# Altium schematic sheet Power_suply.SchDoc: Power suply
size A4; Date: 6.4.2015; Engineer: Matjaz Tome; DocumentNumber: 4; Revision: B1; SheetNumber: 4; SheetTotal: 8; Project: USB DAQ
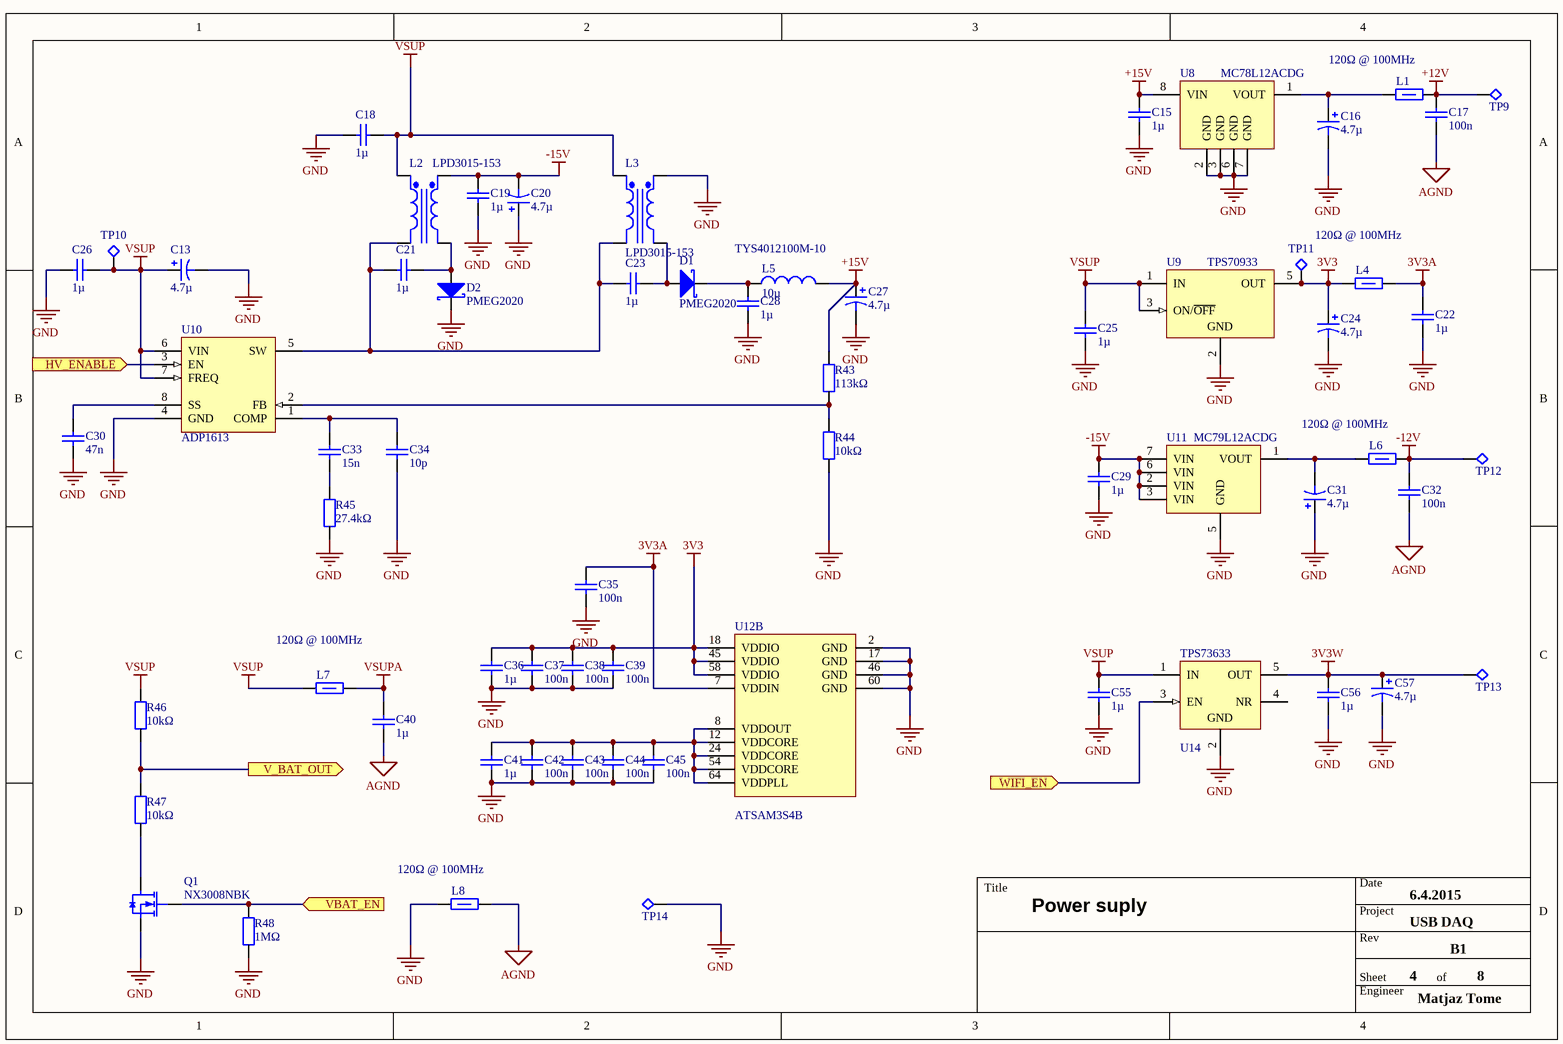
[diagram p0: Power_suply.SchDoc]

## Parts
C13  4.7µ  [A]
C15  1µ  [0603C]
C16  4.7µ  [A]
C17  100n  [0603C]
C18  1µ  [0603C]
C19  1µ  [0603C]
C20  4.7µ  [A]
C21  1µ  [0603C]
C22  1µ  [0603C]
C23  1µ  [0603C]
C24  4.7µ  [A]
C25  1µ  [0603C]
C26  1µ  [0603C]
C27  4.7µ  [A]
C28  1µ  [0603C]
C29  1µ  [0603C]
C30  47n  [0603C]
C31  4.7µ  [A]
C32  100n  [0603C]
C33  15n  [0603C]
C34  10p  [0603C]
C35  100n  [0603C]
C36  1µ  [0603C]
C37  100n  [0603C]
C38  100n  [0603C]
C39  100n  [0603C]
C40  1µ  [0603C]
C41  1µ  [0603C]
C42  100n  [0603C]
C43  100n  [0603C]
C44  100n  [0603C]
C45  100n  [0603C]
C55  1µ  [0603C]
C56  1µ  [0603C]
C57  4.7µ  [A]
D1  PMEG2020  [SOD323]
D2  PMEG2020  [SOD323]
L1  120Ω @ 100MHz  [0805R]
L2  LPD3015-153  [LPD3015]
L3  LPD3015-153  [LPD3015]
L4  120Ω @ 100MHz  [0805R]
L5  10µ  Manufacturer Number: TYS4012100M-10  [ind_4mmX4mm]
L6  120Ω @ 100MHz  [0805R]
L7  120Ω @ 100MHz  [0805R]
L8  120Ω @ 100MHz  [0805R]
Q1  NX3008NBK  [SOT23-3]
R43  113kΩ  [0603R]
R44  10kΩ  [0603R]
R45  27.4kΩ  [0603R]
R46  10kΩ  [0603R]
R47  10kΩ  [0603R]
R48  1MΩ  [0603R]
TP9  testpoint  [TP1_FULL]  (value not drawn)  (no BOM)
TP10  testpoint  [TP1_FULL]  (value not drawn)  (no BOM)
TP11  testpoint  [TP1_FULL]  (value not drawn)  (no BOM)
TP12  testpoint  [TP1_FULL]  (value not drawn)  (no BOM)
TP13  testpoint  [TP1_FULL]  (value not drawn)  (no BOM)
TP14  testpoint  [TP1_FULL]  (value not drawn)  (no BOM)
U8  MC78L12ACDG  [SOIC8]
U9  TPS70933  [SOT23-5]
U10  ADP1613  [MSOP8]
U11  MC79L12ACDG  [SOIC8]
U12  ATSAM3S4B  [LQFP64]  (part B of 2)
U14  TPS73633  [SOT23-5]

## Ports
HV_ENABLE (in), V_BAT_OUT (out), VBAT_EN (in), WIFI_EN (in)

## Nets
3V3: C24.1 C36.2 C37.1 C38.1 C39.1 L4.1 TP11.1 U9.5(OUT) U12.18(VDDIO) U12.45(VDDIO) U12.58(VDDIO)
3V3A: C22.2 C35.1 L4.2 U12.7(VDDIN)
3V3W: C56.2 C57.1 TP13.1 U14.5(OUT)
+12V: C17.1 L1.2 TP9.1
+15V: C15.2 C27.1 L5.2 R43.2 U8.8(VIN)
-12V: C32.1 L6.2 TP12.1
-15V: C19.2 C20.2 C29.2 L2.1 U11.2(VIN) U11.3(VIN) U11.6(VIN) U11.7(VIN)
AGND: C17.2 C32.2 C40.1 L8.2
GND: C13.2 C15.1 C16.2 C18.2 C19.1 C20.1 C22.1 C24.2 C25.1 C26.1 C27.2 C28.1 C29.1 C30.1 C31.1 C34.1 C35.2 C36.1 C37.2 C38.2 C39.2 C41.1 C42.2 C43.2 C44.2 C45.2 C55.1 C56.1 C57.2 D2.2(K) L3.4 L8.1 Q1.2(S) R44.1 R45.1 R48.1 TP14.1 U8.2(GND) U8.3(GND) U8.6(GND) U8.7(GND) U9.2(GND) U10.4(GND) U11.5(GND) U12.2(GND) U12.17(GND) U12.46(GND) U12.60(GND) U14.2(GND)
VSUP: C13.1 C18.1 C25.2 C26.2 C55.2 L2.4 L3.1 L7.1 R46.2 TP10.1 U9.1(IN) U9.3(ON/~{OFF}) U10.6(VIN) U10.7(FREQ) U14.1(IN)
VSUPA: C40.2 L7.2
HV_ENABLE: U10.3(EN) ; port HV_ENABLE
V_BAT_OUT: R46.1 R47.2 ; port V_BAT_OUT
VBAT_EN: Q1.1(G) R48.2 ; port VBAT_EN
WIFI_EN: U14.3(EN) ; port WIFI_EN
NetC16_1: C16.1 L1.1 U8.1(VOUT)
NetC21_1: C21.1 D2.1(A) L2.2
NetC21_2: C21.2 C23.2 L2.3 L3.2 U10.5(SW)
NetC23_1: C23.1 D1.1(A) L3.3
NetC28_2: C28.2 D1.2(K) L5.1
NetC30_2: C30.2 U10.8(SS)
NetC31_2: C31.2 L6.1 U11.1(VOUT)
NetC33_1: C33.1 R45.2
NetC33_2: C33.2 C34.2 U10.1(COMP)
NetC41_2: C41.2 C42.1 C43.1 C44.1 C45.1 U12.8(VDDOUT) U12.12(VDDCORE) U12.24(VDDCORE) U12.54(VDDCORE) U12.64(VDDPLL)
NetQ1_3: Q1.3(D) R47.1
NetR43_1: R43.1 R44.2 U10.2(FB)

Not connected (* = marked no-connect by the designer): U14 4(NR)

## Notes on the sheet
- Title
- Date
- Project
- Rev
- Engineer
- Sheet
- of

## Library data of the parts
C13 C16 C20 C24 C27 C31 C57 = CST0011: tantalum SMD capacitor 4.7µF 16V A case; Manufacturer: Kemet; Manufacturer Number: T491A475M016AT; ESR: 4Ω; Tolerance: 10%; Part Number: CST0011; Category: Capacitors; Supplier part number 1: 2462769; Supplier 1: Farnell; Price: 0.20; Value: 4.7µF; Voltage: 16V; Case: A; Technology: SMT; Dielectric: Tantalum; HelpURL: U:\datasheet\cap\KEMET TANT SMD.pdf
C15 C18 C19 C21-C23 C25 C26 C28 C29 C36 C40 C41 C55 C56 = ZSC0003: ceramic X5R SMD capacitor smd 0603 1µF 50V; Manufacturer: Murata; Manufacturer Number: GRM188R61H105KAALD; Tolerance: 10%; Part Number: ZSC0003; Category: capacitors; Price: 0.144; Value: 1µF; Voltage: 50V; Case: 0603; Technology: SMT; Dielectric: X5R; HelpURL: U:\datasheet\cap\Murata\GRM\GRM188R61H105KAALD.pdf; SKU: 1020300000001; Supplier part number 1: 1845736; Supplier 1: Farnell
C17 C32 C35 C37-C39 C42-C45 = RSC0013: ceramic X7R SMD capacitor smd 0603 100nF 16V; Manufacturer: Murata; Manufacturer Number: GRM188R71C104KA01D; Dealer number: 1828890; Dealer: Farnell; Tolerance: 10%; Part Number: RSC0013; Category: capacitors; Price: 0.042; Value: 100nF; Voltage: 16V; Case: 0603; Technology: SMT; Dielectric: X7R; HelpURL: U:\datasheet\cap\Murata\GRM\GRM188R71C104KA01D.pdf; Supplier 1: Farnell; Supplier Part Number 1: 1828890
C30 = RSC0007: ceramic X7R SMD capacitor smd 0603 47nF 16V; Manufacturer: Multicomp; Manufacturer Number: MC0603B473K160CT; Dealer number: 1759011; Dealer: Farnell; Tolerance: 10%; Part Number: RSC0007; Category: capacitors; Price: 0.009; Value: 47nF; Voltage: 16V; Case: 0603; Technology: SMT; Dielectric: X7R; HelpURL: U:\datasheet\cap\MULTICOMP_2.pdf; Supplier 1: Farnell; Supplier Part Number 1: 1759011
C33 = RSC0015: ceramic X7R SMD capacitor smd 0603 15nF 100V; Manufacturer: Kemet; Manufacturer Number: C0603C153K1RACTU; Dealer number: 1865546; Dealer: Farnell; Tolerance: 10%; Part Number: RSC0015; Category: capacitors; Price: 0.019; Value: 15nF; Voltage: 100V; Case: 0603; Technology: SMT; Dielectric: X7R; HelpURL: U:\datasheet\cap\KEMET X7R SMD.pdf; SKU: 1020100000009; Supplier 1: Farnell; Supplier Part Number 1: 1865546
C34 = GSC0019: ceramic C0G SMD capacitor smd 0603 10pF 100V; Manufacturer: Kemet; Manufacturer Number: C0603C100J1GACTU; Dealer number: 1414600; Dealer: Farnell; Tolerance: 5%; Part Number: GSC0019; Category: capacitors; Price: 0.038; Value: 10pF; Voltage: 100V; Case: 0603; Technology: SMT; Dielectric: C0G; HelpURL: U:\datasheet\cap\KEMET C0G SMD.pdf; SKU: 1020000000004; Supplier 1: Farnell; Supplier part number 1: 1414600
D1 D2 = XDS0004: Shotkey diode 2A 20V; Manufacturer: Infineon; Manufacturer Number: PMEG2020AEA; Part Number: XDS0004; Category: diodes; Price: 0.126; Max  Reverse Voltage: 20V; Max current: 2A; Case: SOD323; Technology: SMT; HelpURL: U:\datasheet\shotkey\PMEG2020.pdf; Supplier part number 1: 8737940; Supplier 1: Farnell
L1 L4 L6-L8 = XFB0000: Ferrite bead, 0.15Ω, 200mA, 0805, 120E @ 100MHz; Manufacturer: Murata; Manufacturer Number: BLM21AG121SN1D; Dealer number: 1515617; Dealer: Farnell; Max current: 0.2A; Part Number: XFB0000; Category: ferite beads; Price: 0.082; DC resistance: 0.15Ω; AC resistance: 120Ω; Frequency: 100MHz; Case: 0805; Technology: SMT; HelpURL: U:\datasheet\ferrite_beads\BLM21A.pdf; Supplier 1: Farnell; Supplier part number 1: 1515617
L2 L3 = XCI0000: Coupled Inductors; Manufacturer: Coilcraft; Manufacturer Number: LPD3015-153MRB; Value: 15µH; Current RMS: 460mA; Current Satturation: 500mA; Resistance: 1.42Ω; Tolerance: 20%; Part Number: XCI0000; Category: Inductors; Price: 0.82; Case: LPD3015; Technology: SMT; HelpURL: U:\datasheet\inductors_coupled\LPD3015.pdf; Supplier part number 1: 2407927; Supplier 1: Farnell
L5 = XXI0000: SMD inductor 10µH, 0.8A; Manufacturer: Laird Technologies; Type: Power; Dealer number: 2292514; Dealer: Farnell; Current RMS: 770mA; Current Satturation: 800mA; Resistance: 0.265Ω; Tolerance: 20%; Part Number: XXI0000; Category: Inductors; Price: 0.26; Value: 10µH; Case: 4mm X 4mm; Technology: SMT; HelpURL: U:\datasheet\inductors_smd\power\TYS4012100M-10.pdf; Supplier 1: Farnell; Supplier Part Number 1: 2292514
Q1 = XMN0003: 30V 0.4A N-mosfet; Manufacturer: NXP; RDS: 1Ω; Max power disipation: 350mW; Type: N-enhancment mode; Logic level: Yes; Part Number: XMN0003; Category: mosfets; Supplier part number 1: 2069541; Supplier 1: Farnell; Price: 0.053; Manufacturer Number: NX3008NBK; Max voltage: 30V; Max current: 0.4A; Case: SOT23-3; Technology: SMT; HelpURL: U:\datasheet\nmos\NX3008NBK.pdf
R43 = YRS0021: resistor smd 0603 113kΩ 1% 0.1w; Manufacturer: Vishay; Manufacturer Number: CRCW0603113KFKEA; Dealer number: 2138502; Dealer: Farnell; Temperature coefficient: 100ppm; Part Number: YRS0021; Category: resistors; Price: 0.007€; Value: 113kΩ; Power: 0.1W; Tolerance: 1%; Case: 0603; Technology: SMT; Material: Metal film - thick / Metal film; HelpURL: U:\datasheet\res\VISHAY CRCW0603.pdf; SKU: 1000000000004; Supplier 1: Farnell; Supplier part number 1: 2138502
R44 R46 R47 = YRS0016: resistor smd 0603 10kΩ 1% 0.1w; Manufacturer: Vishay; Manufacturer Number: CRCW060310K0FKEA; Dealer number: 1469748; Dealer: Farnell; Temperature coefficient: 100ppm; Part Number: YRS0016; Category: resistors; Price: 0.0143€; Value: 10kΩ; Power: 0.1W; Tolerance: 1%; Case: 0603; Technology: SMT; Material: Metal film - thick / Metal film; HelpURL: U:\datasheet\res\VISHAY CRCW0603.pdf; SKU: 1000000000002; Supplier 1: Farnell; Supplier part number 1: 1469748
R45 = YRS0020: resistor smd 0603 27.4kΩ 1% 0.1w; Manufacturer: Vishay; Manufacturer Number: CRCW060327K4FKEA; Dealer number: 1652865; Dealer: Farnell; Temperature coefficient: 100ppm; Part Number: YRS0020; Category: resistors; Price: 0.084€; Value: 27.4kΩ; Power: 0.1W; Tolerance: 1%; Case: 0603; Technology: SMT; Material: Metal film - thick / Metal film; HelpURL: U:\datasheet\res\VISHAY CRCW0603.pdf; Supplier 1: Farnell; Supplier part number 1: 1652865
R48 = XRS0035: resistor smd 0603 1MΩ 5% 0.1w; Manufacturer: Multicomp; Manufacturer Number: MCMR06X105 JTL; Temperature coefficient: 100ppm; Part Number: XRS0035; Category: resistors; Price: 0.009€; Value: 1MΩ; Power: 0.1W; Tolerance: 5%; Case: 0603; Technology: SMT; Material: Metal film / Metal film; HelpURL: U:\datasheet\res\MULTICOMP 0603.pdf; SKU: 1000100000012; Supplier part number 1: 2073358; Supplier 1: Farnell
TP9-TP14 = XXC0006: testpoint 1.5mm diameter no hole; Part Number: XXC0006; Category: testpoints
U8 = XLR0006: 100 mA Positive Voltage / Regulator; Manufacturer: ON Semiconductors; Output Voltage: 12V; Max input voltage: 35V; Output current: 100mA; Voltage tolerance: 5%; Teperature range: 0°C to +150°C; LDO: No; Part Number: XLR0006; Category: Integrated circuits; Price: 0.43; Manufacturer Number: MC78L12ACDG; Low noise: No; Case: SOIC8; Technology: SMT; HelpURL: U:\datasheet\linear_reg\MC78LXX.pdf; Supplier part number 1: 9666273; Supplier 1: Farnell
U9 = XLR0012: 1-µA IQ Voltage Regulators with Enable; Manufacturer: Texas Instruments; Manufacturer Number: TPS70933DBVT; Output Voltage: 3.3V; Max input voltage: 30V; Output current: 150mA; Teperature range: -40°C to +85°C; LDO: Yes; Low noise: No; Part Number: XLR0012; Category: Integrated circuits; Price: 0.86; Case: SOT23-5; Technology: SMT; HelpURL: U:\datasheet\linear_reg\TPS709xx.pdf; Supplier part number 1: 2382995; Supplier 1: Farnell
U10 = XSW0008: 650 kHz /1.3 MHz Step-Up PWM DC-to-DC Switching Converters / REGULATORS / Synchronous Step-Down DC-DC Converter; Manufacturer: Analog devices; Manufacturer Number: ADP1613ARMZ-R7; Dealer number: 2102527; Dealer: Farnell; Switching element: Internal; Synchronious: No; Input voltage max: 5.5V; Input voltage min: 2.5V; Output voltage max: 20V; Output voltage min: 3.6V; Max output current: 1.5A; Part Number: XSW0008; Category: Integrated circuits; Price: 1.63; Type: Boost; Case: MSOP8; Multyphaze: No; Ext Cock: No; Technology: SMT; HelpURL: U:\datasheet\switchers\ADP161X.pdf; Supplier 1: Farnell; Supplier part number 1: 2102527
U11 = XLR0007: 100 mA Negative Voltage / Regulator; Manufacturer: ON Semiconductors; Output Voltage: -12V; Max input voltage: -14V; Output current: 100mA; Voltage tolerance: 5%; Teperature range: 0°C to +150°C; LDO: No; Part Number: XLR0007; Category: Integrated circuits; Price: 0.52; Manufacturer Number: MC79L12ACDG; Low noise: No; Case: SOIC8; Technology: SMT; HelpURL: U:\datasheet\linear_reg\MC79LXX.pdf; Supplier part number 1: 1652361; Supplier 1: Farnell
U12 = XAM0003: Cortex M3 ARM microcontroller; Manufacturer: Atmel; Manufacturer Number: ATSAM3S4BA-AU; Dealer number: 1841656; Dealer: Farnell; Core: Cortex-M3; Supply voltage max: 3.6V; Supply voltage min: 1.62V; Flash: 256kB; RAM: 48kB; GPIOs: 47; Timers: 3; ADCs: 8; SPI: 1; IIC: 2; Max Frequency: 64MHz; Part Number: XAM0003; Category: Integrated circuits; Price: 6.58; UART: 3; Case: LQFP64; Technology: SMT; HelpURL: U:\datasheet\microcontrollers\arm\SAM3SXA.pdf; Temperature range: -40°C to +85°C; Supplier 1: Farnell; Supplier part number 1: 1841656
U14 = XLR0013: Cap-Free, NMOS, 400-mA Low-Dropout Regulator with Reverse Current Protection; Manufacturer: Texas instruments; Manufacturer Number: TPS73633DBV; Output Voltage: 3.3V; Max input voltage: 5.5V; Output current: 400mA; Voltage tolerance: 1%; Teperature range: -40°C to +125°C; LDO: Yes; Low noise: No; Part Number: XLR0013; Category: Integrated circuits; Price: 2.53; Case: SOT23-5; Technology: SMT; HelpURL: U:\datasheet\linear_reg\TPS736.pdf; Supplier part number 1: 1207346; Supplier 1: Farnell